# Altium schematic sheet Copy of PCI Express_16765X6890_98PIN_Low profile.schdoc: PCI Express x8 Top Sheet
size A3; SheetNumber: 1; SheetTotal: 2
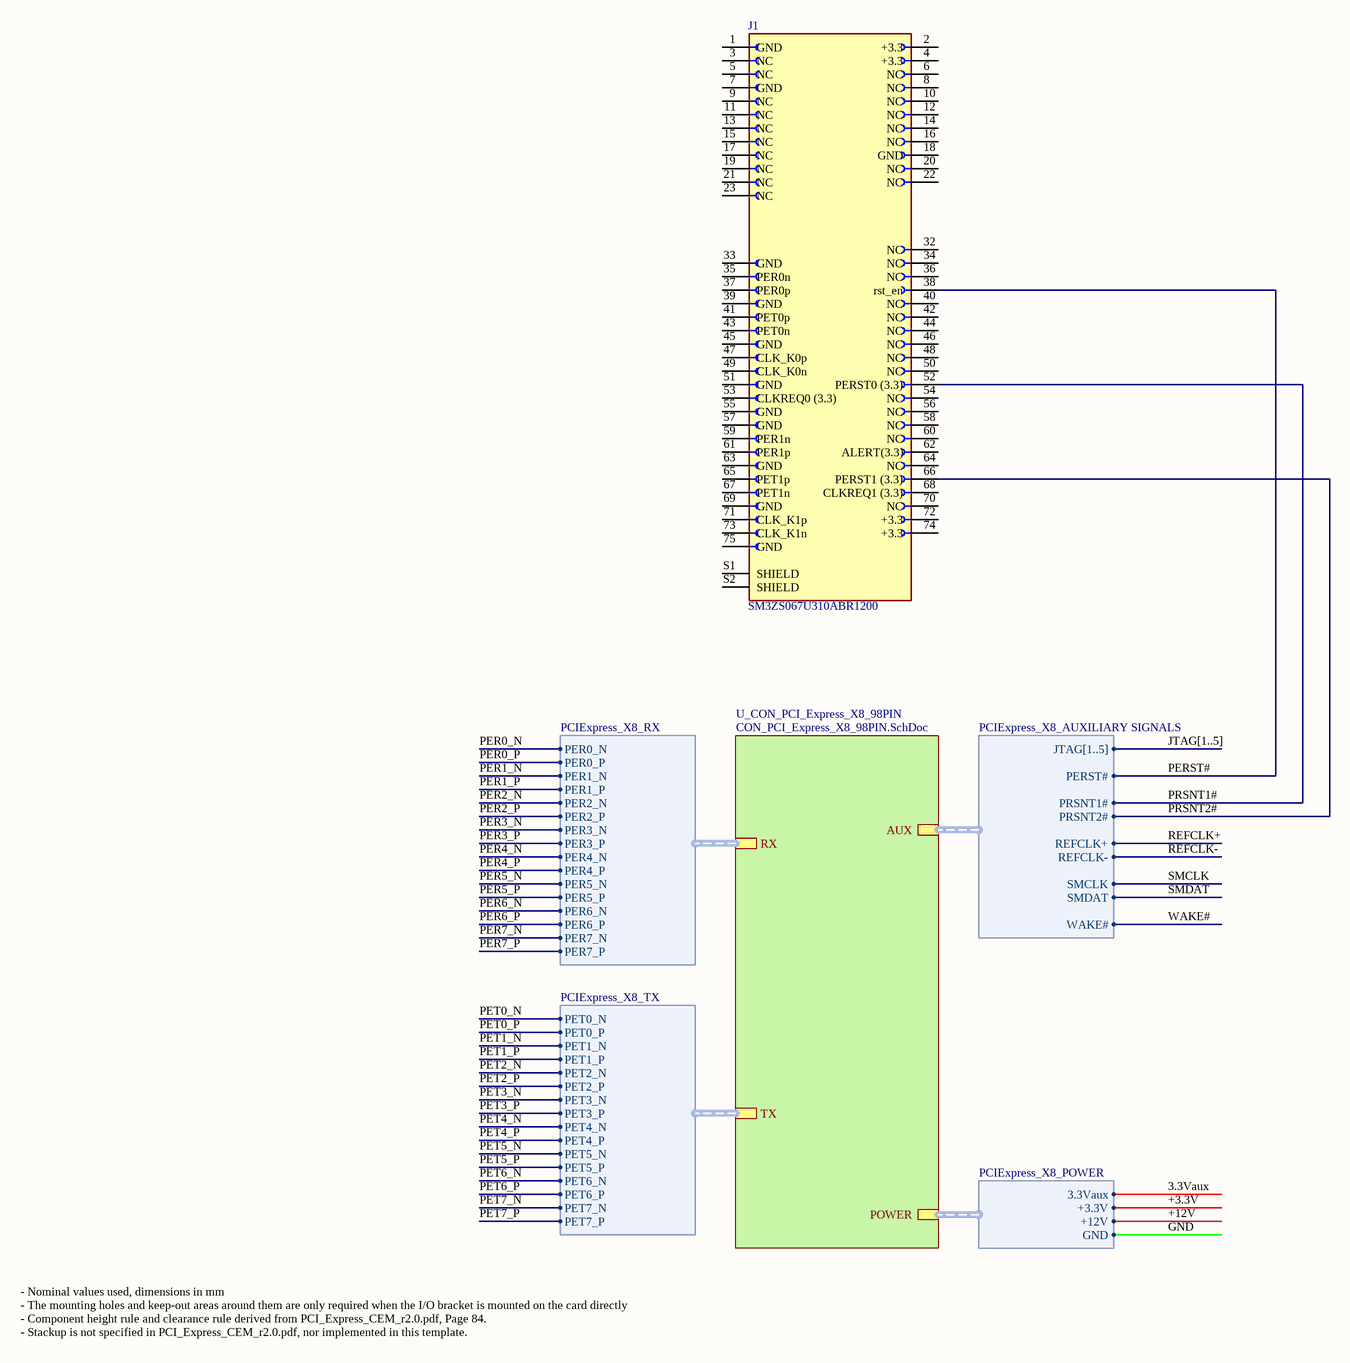
[diagram p0: Copy of PCI Express_16765X6890_98PIN_Low profile.schdoc]

## Parts
J1  SM3ZS067U310ABR1200  [JAE_SM3ZS067U310ABR1200]

## Sub-sheets
U_CON_PCI_Express_X8_98PIN = CON_PCI_Express_X8_98PIN.SchDoc: POWER (harness PCIExpress_X8_POWER), AUX (harness PCIExpress_X8_AUXILIARY SIGNALS), RX (harness PCIExpress_X8_RX), TX (harness PCIExpress_X8_TX)

## Harnesses
PCIExpress_X8_RX: PER0_N, PER0_P, PER1_N, PER1_P, PER2_N, PER2_P, PER3_N, PER3_P, PER4_N, PER4_P, PER5_N, PER5_P, PER6_N, PER6_P, PER7_N, PER7_P
PCIExpress_X8_TX: PET0_N, PET0_P, PET1_N, PET1_P, PET2_N, PET2_P, PET3_N, PET3_P, PET4_N, PET4_P, PET5_N, PET5_P, PET6_N, PET6_P, PET7_N, PET7_P
PCIExpress_X8_POWER: +3.3V, +12V, GND, 3.3Vaux
PCIExpress_X8_AUXILIARY SIGNALS: JTAG[1..5], PERST#, PRSNT1#, PRSNT2#, REFCLK+, REFCLK-, SMCLK, SMDAT, WAKE#

## Nets
3.3Vaux: sheet U_CON_PCI_Express_X8_98PIN/POWER.3.3Vaux
+3.3V: sheet U_CON_PCI_Express_X8_98PIN/POWER.+3.3V
+12V: sheet U_CON_PCI_Express_X8_98PIN/POWER.+12V
GND: sheet U_CON_PCI_Express_X8_98PIN/POWER.GND
PER0_N: sheet U_CON_PCI_Express_X8_98PIN/RX.PER0_N
PER0_P: sheet U_CON_PCI_Express_X8_98PIN/RX.PER0_P
PER1_N: sheet U_CON_PCI_Express_X8_98PIN/RX.PER1_N
PER1_P: sheet U_CON_PCI_Express_X8_98PIN/RX.PER1_P
PER2_N: sheet U_CON_PCI_Express_X8_98PIN/RX.PER2_N
PER2_P: sheet U_CON_PCI_Express_X8_98PIN/RX.PER2_P
PER3_N: sheet U_CON_PCI_Express_X8_98PIN/RX.PER3_N
PER3_P: sheet U_CON_PCI_Express_X8_98PIN/RX.PER3_P
PER4_N: sheet U_CON_PCI_Express_X8_98PIN/RX.PER4_N
PER4_P: sheet U_CON_PCI_Express_X8_98PIN/RX.PER4_P
PER5_N: sheet U_CON_PCI_Express_X8_98PIN/RX.PER5_N
PER5_P: sheet U_CON_PCI_Express_X8_98PIN/RX.PER5_P
PER6_N: sheet U_CON_PCI_Express_X8_98PIN/RX.PER6_N
PER6_P: sheet U_CON_PCI_Express_X8_98PIN/RX.PER6_P
PER7_N: sheet U_CON_PCI_Express_X8_98PIN/RX.PER7_N
PER7_P: sheet U_CON_PCI_Express_X8_98PIN/RX.PER7_P
PERST#: J1.38(rst_en) ; sheet U_CON_PCI_Express_X8_98PIN/AUX.PERST#
PET0_N: sheet U_CON_PCI_Express_X8_98PIN/TX.PET0_N
PET0_P: sheet U_CON_PCI_Express_X8_98PIN/TX.PET0_P
PET1_N: sheet U_CON_PCI_Express_X8_98PIN/TX.PET1_N
PET1_P: sheet U_CON_PCI_Express_X8_98PIN/TX.PET1_P
PET2_N: sheet U_CON_PCI_Express_X8_98PIN/TX.PET2_N
PET2_P: sheet U_CON_PCI_Express_X8_98PIN/TX.PET2_P
PET3_N: sheet U_CON_PCI_Express_X8_98PIN/TX.PET3_N
PET3_P: sheet U_CON_PCI_Express_X8_98PIN/TX.PET3_P
PET4_N: sheet U_CON_PCI_Express_X8_98PIN/TX.PET4_N
PET4_P: sheet U_CON_PCI_Express_X8_98PIN/TX.PET4_P
PET5_N: sheet U_CON_PCI_Express_X8_98PIN/TX.PET5_N
PET5_P: sheet U_CON_PCI_Express_X8_98PIN/TX.PET5_P
PET6_N: sheet U_CON_PCI_Express_X8_98PIN/TX.PET6_N
PET6_P: sheet U_CON_PCI_Express_X8_98PIN/TX.PET6_P
PET7_N: sheet U_CON_PCI_Express_X8_98PIN/TX.PET7_N
PET7_P: sheet U_CON_PCI_Express_X8_98PIN/TX.PET7_P
PRSNT1#: J1.52(PERST0_(3.3)) ; sheet U_CON_PCI_Express_X8_98PIN/AUX.PRSNT1#
PRSNT2#: J1.66(PERST1_(3.3)) ; sheet U_CON_PCI_Express_X8_98PIN/AUX.PRSNT2#
REFCLK+: sheet U_CON_PCI_Express_X8_98PIN/AUX.REFCLK+
REFCLK-: sheet U_CON_PCI_Express_X8_98PIN/AUX.REFCLK-
SMCLK: sheet U_CON_PCI_Express_X8_98PIN/AUX.SMCLK
SMDAT: sheet U_CON_PCI_Express_X8_98PIN/AUX.SMDAT
WAKE#: sheet U_CON_PCI_Express_X8_98PIN/AUX.WAKE#

Not connected (* = marked no-connect by the designer): J1 1(GND) 2(+3.3) 3(NC) 4(+3.3) 5(NC) 6(NC) 7(GND) 8(NC) 9(NC) 10(NC) 11(NC) 12(NC) 13(NC) 14(NC) 15(NC) 16(NC) 17(NC) 18(GND) 19(NC) 20(NC) 21(NC) 22(NC) 23(NC) 32(NC) 33(GND) 34(NC) 35(PER0n) 36(NC) 37(PER0p) 39(GND) 40(NC) 41(PET0p) 42(NC) 43(PET0n) 44(NC) 45(GND) 46(NC) 47(CLK_K0p) 48(NC) 49(CLK_K0n) 50(NC) 51(GND) 53(CLKREQ0_(3.3)) 54(NC) 55(GND) 56(NC) 57(GND) 58(NC) 59(PER1n) 60(NC) 61(PER1p) 62(ALERT(3.3)) 63(GND) 64(NC) 65(PET1p) 67(PET1n) 68(CLKREQ1_(3.3)) 69(GND) 70(NC) 71(CLK_K1p) 72(+3.3) 73(CLK_K1n) 74(+3.3) 75(GND) S1(SHIELD) S2(SHIELD)

## Buses and harness runs
bus JTAG[1..5]

## Notes on the sheet
- - Nominal values used, dimensions in mm
  - The mounting holes and keep-out areas around them are only required when the I/O bracket is mounted on the card directly
  - Component height rule and clearance rule derived from PCI_Express_CEM_r2.0.pdf, Page 84.
  - Stackup is not specified in PCI_Express_CEM_r2.0.pdf, nor implemented in this template.
- Title
- Size:
- Date:
- A3
- Number:
- Time:
- Revision:
- Sheet
- of
- File:

## Library data of the parts
J1 = SM3ZS067U310ABR1200: 67 Position Female Connector M.2 (NGFF) Mini Card Gold 0.020 (0.50mm); MF: JAE Electronics; Availability: Warning; MP: SM3ZS067U310ABR1200; SnapEDA_Link: https://www.snapeda.com/parts/SM3ZS067U310ABR1200/JAE%20Electronics/view-part/652226/?ref=snap; Purchase-URL: https://pricing.snapeda.com/search/part/SM3ZS067U310ABR1200/?ref=eda; Package: None; Check_prices: https://www.snapeda.com/parts/SM3ZS067U310ABR1200/JAE%20Electronics/view-part/652226/?ref=eda; Value: *; Price: None